# Altium schematic sheet Voice.SchDoc
size A4; Date: 2020/05/29
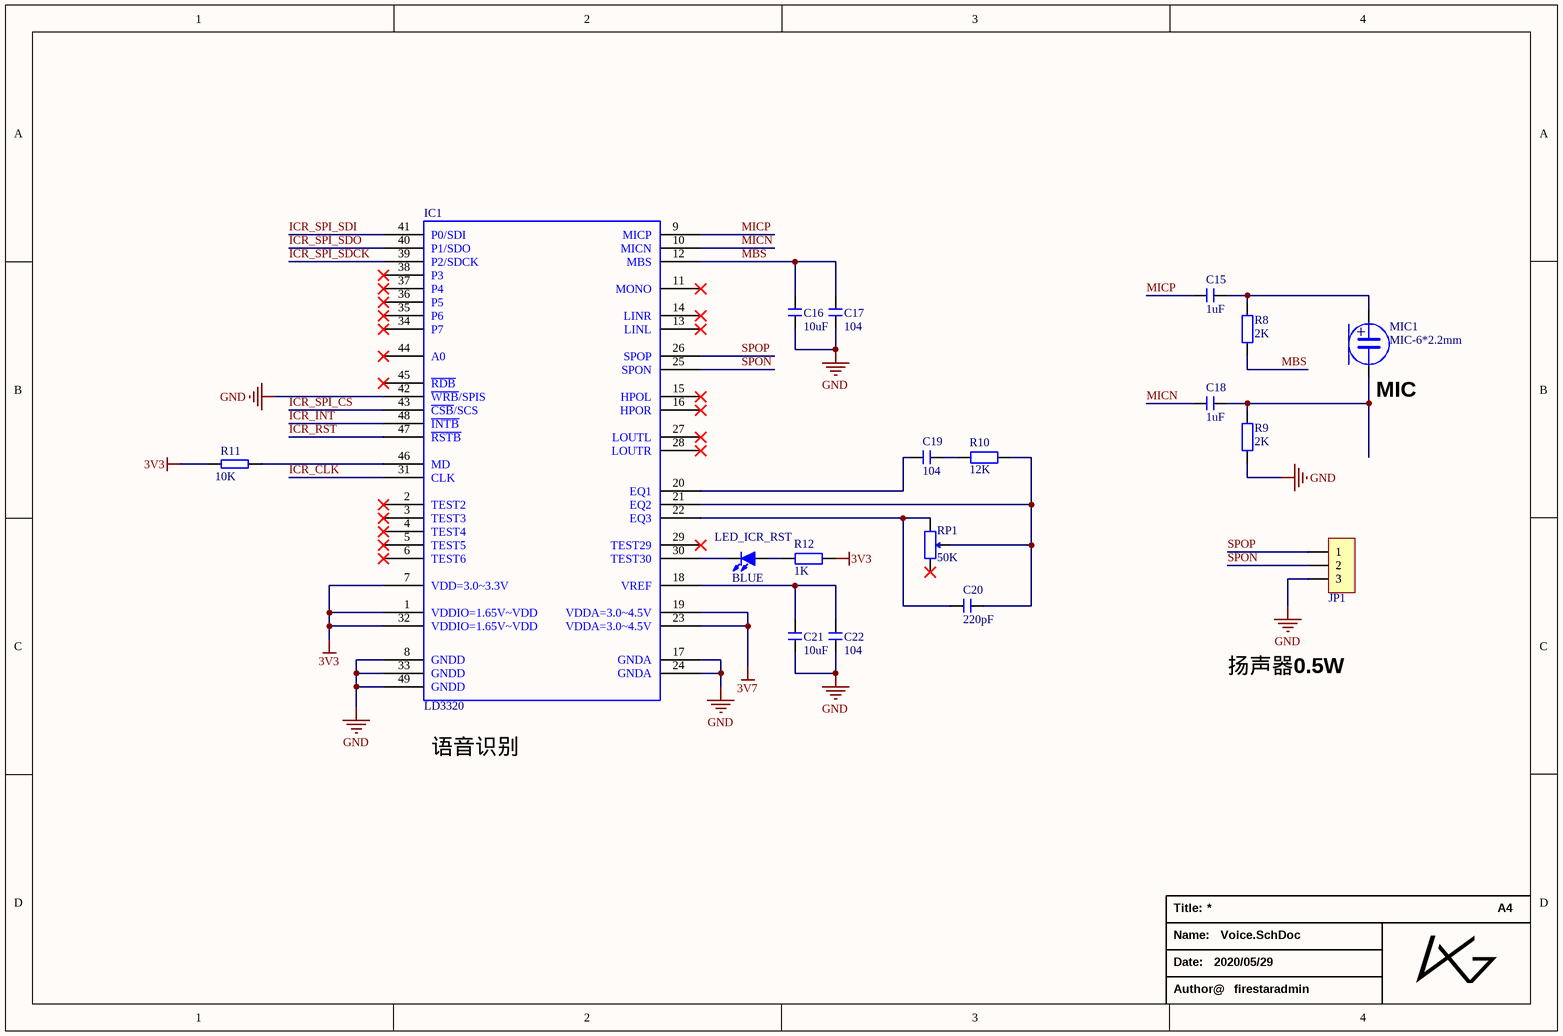
[diagram p0: Voice.SchDoc]

## Parts
C15  1uF  [C 0603_M]
C16  10uF  [C 0805_M]
C17  104  [C 0603_M]
C18  1uF  [C 0603_M]
C19  104  [C 0603_M]
C20  220pF  [C 0603_M]
C21  10uF  [C 0805_M]
C22  104  [C 0603_M]
IC1  LD3320  [QFN48 7X7_M]
JP1  HDR-1X3  [HDR2.54-LI-3P]  (value not drawn)
LED_ICR_RST  BLUE  [LED 0603B]
MIC1  MIC-6*2.2mm  [MIC-6*2.2MM]
R8  2K  [R 0805_M]
R9  2K  [R 0805_M]
R10  12K  [R 0805_M]
R11  10K  [R 0603_M]
R12  1K  [R 0805_M]
RP1  50K  [3306W]

## Nets
3V3: IC1.1(VDDIO=1.65V~VDD) IC1.7(VDD=3.0~3.3V) IC1.32(VDDIO=1.65V~VDD) R11.1 R12.2
3V7: IC1.19(VDDA=3.0~4.5V) IC1.23(VDDA=3.0~4.5V)
GND: C16.1 C17.1 C21.1 C22.1 IC1.8(GNDD) IC1.17(GNDA) IC1.24(GNDA) IC1.33(GNDD) IC1.42(~{WRB}/SPIS) IC1.49(GNDD) JP1.3 R9.1
ICR_CLK: IC1.31(CLK)
ICR_INT: IC1.48(~{INTB})
ICR_RST: IC1.47(~{RSTB})
ICR_SPI_CS: IC1.43(~{CSB}/SCS)
ICR_SPI_SDCK: IC1.39(P2/SDCK)
ICR_SPI_SDI: IC1.41(P0/SDI)
ICR_SPI_SDO: IC1.40(P1/SDO)
MBS: C16.2 C17.2 IC1.12(MBS) R8.1
MICN: C18.2 IC1.10(MICN)
MICP: C15.2 IC1.9(MICP)
SPON: IC1.25(SPON) JP1.2
SPOP: IC1.26(SPOP) JP1.1
NetC15_1: C15.1 MIC1.1 R8.2
NetC18_1: C18.1 MIC1.2 R9.2
NetC19_1: C19.1 R10.1
NetC19_2: C19.2 IC1.20(EQ1)
NetC20_1: C20.1 IC1.21(EQ2) R10.2 RP1.2
NetC20_2: C20.2 IC1.22(EQ3) RP1.1
NetC21_2: C21.2 C22.2 IC1.18(VREF)
NetIC1_30: IC1.30(TEST30) LED_ICR_RST.2(K)
NetIC1_46: IC1.46(MD) R11.2
NetLED_ICR_RST_1: LED_ICR_RST.1(A) R12.1

Not connected (* = marked no-connect by the designer): IC1 2(TEST2)* 3(TEST3)* 4(TEST4)* 5(TEST5)* 6(TEST6)* 11(MONO)* 13(LINL)* 14(LINR)* 15(HPOL)* 16(HPOR)* 27(LOUTL)* 28(LOUTR)* 29(TEST29)* 34(P7)* 35(P6)* 36(P5)* 37(P4)* 38(P3)* 44(A0)* 45(~{RDB})*; RP1 3*

## Notes on the sheet
- (near MIC1) MIC
- 扬声器0.5W
- (near IC1) 语音识别
- Title:
- A4
- Name:
- Date:
- Author@
- firestaradmin
- (in symbol MIC1) +

## Library data of the parts
C15-C22 = C: 无极性贴片电容; 版权归属: 源创客; BOM名称: 无极性贴片电容; 学习资源: www.ooocke.com
IC1 = LD3320: LD3320 芯片是一款“ 语音识别”专用芯片，由 ICRoute 公司设计生产。该芯 / 片集成了语音识别处理器和一些外部电路，包括 AD、DA 转换器、麦克风接口、 / 声音输出接口等。本芯片在设计上注重节能与高效，不需要外接任何的辅助芯片 / 如 Flash、RAM 等，直接集成在现有的产品中即可以实现语音识别/声控/人机对 / 话功能。并且，识别的关键词语列表是可以任意动态编辑的。
JP1 = Header 3: 3P接插件; 版权归属: 源创客; BOM名称: 3P接插件; 学习资源: www.ooocke.com
LED_ICR_RST = LED-SMD: 贴片LED; 版权归属: 源创客; BOM名称: 贴片LED; 学习资源: www.ooocke.com
MIC1 = MIC1: 电容麦克风; 版权归属: 源创客; BOM名称: 电容麦克风; 学习资源: www.ooocke.com
R8-R10 R12 = R: 贴片电阻; 版权归属: 源创客; BOM名称: 贴片电阻; 学习资源: www.ooocke.com
R11 = R
RP1 = RP-ID: 插件单联电位器; BOM名称: 插件电位器; 版权归属: 源创客; 学习资源: www.ooocke.com